# Altium project AT89S52S双L298驱动控制器.PRJPCB
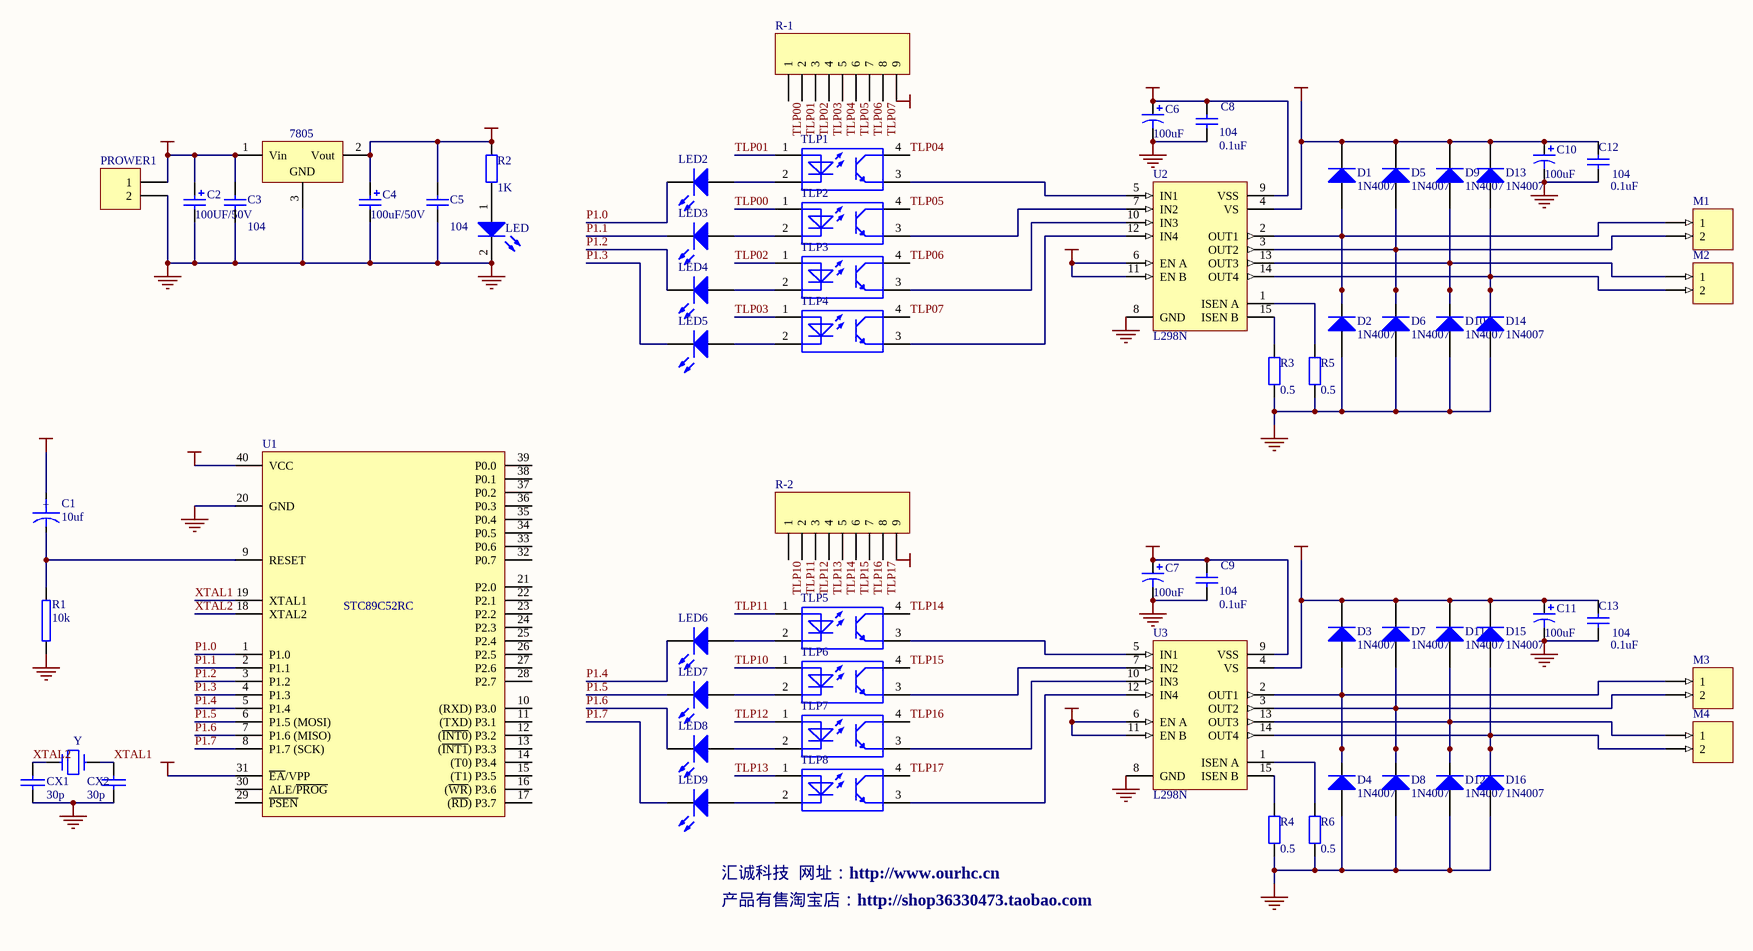
[diagram p0: AT89S52S双L298驱动控制器.SCHDOC]
1 sheet, 66 parts. Net scope: global (net labels, ports and power ports of the same name join across sheets).
Board file: AT89S52S双L298驱动控制器.PCBDOC

## Sheet AT89S52S双L298驱动控制器.SCHDOC
size A3

### Parts
7805  SDWYG  [WYG]  (value not drawn)
C1  10uf  [C-DJ-4]
C2  value 100UF/50V  [C-DJ-6]  (hidden comment: DJDR)
C3  value 104  [CPDR]  (hidden comment: CPDR)
C4  value 100uF/50V  [C-DJ-6]  (hidden comment: DJDR)
C5  value 104  [CPDR]  (hidden comment: CPDR)
C6  value 100uF  [C-DJ-6]
C7  value 100uF  [C-DJ-6]
C8  104  value 0.1uF  [CPDR]
C9  104  value 0.1uF  [CPDR]
C10  value 100uF  [C-DJ-6]
C11  value 100uF  [C-DJ-6]
C12  104  value 0.1uF  [CPDR]
C13  104  value 0.1uF  [CPDR]
CX1  30p  [HDR1X2]
CX2  30p  [HDR1X2]
D1  1N4007  [DIO7.8-4.6x2]
D2  1N4007  [DIO7.8-4.6x2]
D3  1N4007  [DIO7.8-4.6x2]
D4  1N4007  [DIO7.8-4.6x2]
D5  1N4007  [DIO7.8-4.6x2]
D6  1N4007  [DIO7.8-4.6x2]
D7  1N4007  [DIO7.8-4.6x2]
D8  1N4007  [DIO7.8-4.6x2]
D9  1N4007  [DIO7.8-4.6x2]
D10  1N4007  [DIO7.8-4.6x2]
D11  1N4007  [DIO7.8-4.6x2]
D12  1N4007  [DIO7.8-4.6x2]
D13  1N4007  [DIO7.8-4.6x2]
D14  1N4007  [DIO7.8-4.6x2]
D15  1N4007  [DIO7.8-4.6x2]
D16  1N4007  [DIO7.8-4.6x2]
LED1  LED  [LED_D]
LED2  (no value)  [LED_D]
LED3  (no value)  [LED_D]
LED4  (no value)  [LED_D]
LED5  (no value)  [LED_D]
LED6  (no value)  [LED_D]
LED7  (no value)  [LED_D]
LED8  (no value)  [LED_D]
LED9  (no value)  [LED_D]
M1  (no value)  [DYDZ]
M2  (no value)  [DYDZ]
M3  (no value)  [DYDZ]
M4  (no value)  [DYDZ]
PROWER1  PZ_2  [DYDZ]  (value not drawn)
R1  10k  [RSE]
R2  value 1K  [RSE]  (hidden comment: Res)
R3  value 0.5  [ZCDZL]  (hidden comment: Res2)
R4  value 0.5  [ZCDZL]  (hidden comment: Res2)
R5  value 0.5  [ZCDZL]  (hidden comment: Res2)
R6  value 0.5  [ZCDZL]  (hidden comment: Res2)
R-1  (no value)  [HDR1X9]
R-2  (no value)  [HDR1X9]
TLP1  (no value)  [DIP-4]
TLP2  (no value)  [DIP-4]
TLP3  (no value)  [DIP-4]
TLP4  (no value)  [DIP-4]
TLP5  (no value)  [DIP-4]
TLP6  (no value)  [DIP-4]
TLP7  (no value)  [DIP-4]
TLP8  (no value)  [DIP-4]
U1  STC89C52RC  [DIP-40]
U2  L298N  [L298N]
U3  L298N  [L298N]
Y1  Y  [JZ_ZC]

### Nets
+5V: 7805.2(Vout) C1.1 C4.1 C5.2 C6.1 C7.1 C8.2 C9.2 R2.2 R-1.9 R-2.9 U1.31(~{EA}/VPP) U1.40(VCC) U2.6(EN_A) U2.9(VSS) U2.11(EN_B) U3.6(EN_A) U3.9(VSS) U3.11(EN_B)
+12V: 7805.1(Vin) C2.1 C3.2 C10.1 C11.1 C12.2 C13.2 D1.2(K) D3.2(K) D5.2(K) D7.2(K) D9.2(K) D11.2(K) D13.2(K) D15.2(K) PROWER1.1 U2.4(VS) U3.4(VS)
GND: 7805.3(GND) C2.2 C3.1 C4.2 C5.1 C6.2 C7.2 C8.1 C9.1 C10.2 C11.2 C12.1 C13.1 CX1.2 CX2.2 D2.1(A) D4.1(A) D6.1(A) D8.1(A) D10.1(A) D12.1(A) D14.1(A) D16.1(A) LED1.2(K) PROWER1.2 R1.1 R3.1 R4.1 R5.1 R6.1 U1.20(GND) U2.8(GND) U3.8(GND)
P1.0: LED2.2(K) U1.1(P1.0)
P1.1: LED3.2(K) U1.2(P1.1)
P1.2: LED4.2(K) U1.3(P1.2)
P1.3: LED5.2(K) U1.4(P1.3)
P1.4: LED6.2(K) U1.5(P1.4)
P1.5: LED7.2(K) U1.6(P1.5_(MOSI))
P1.6: LED8.2(K) U1.7(P1.6_(MISO))
P1.7: LED9.2(K) U1.8(P1.7_(SCK))
TLP00: R-1.1 TLP2.1
TLP01: R-1.2 TLP1.1
TLP02: R-1.3 TLP3.1
TLP03: R-1.4 TLP4.1
TLP04: R-1.5 TLP1.4
TLP05: R-1.6 TLP2.4
TLP06: R-1.7 TLP3.4
TLP07: R-1.8 TLP4.4
TLP10: R-2.1 TLP6.1
TLP11: R-2.2 TLP5.1
TLP12: R-2.3 TLP7.1
TLP13: R-2.4 TLP8.1
TLP14: R-2.5 TLP5.4
TLP15: R-2.6 TLP6.4
TLP16: R-2.7 TLP7.4
TLP17: R-2.8 TLP8.4
XTAL1: CX2.1 U1.19(XTAL1) Y1.1
XTAL2: CX1.1 U1.18(XTAL2) Y1.2
NetC1_2: C1.2 R1.2 U1.9(RESET)
NetD1_1: D1.1(A) D2.2(K) M1.1 U2.2(OUT1)
NetD3_1: D3.1(A) D4.2(K) M3.1 U3.2(OUT1)
NetD5_1: D5.1(A) D6.2(K) M1.2 U2.3(OUT2)
NetD7_1: D7.1(A) D8.2(K) M3.2 U3.3(OUT2)
NetD9_1: D9.1(A) D10.2(K) M2.1 U2.13(OUT3)
NetD11_1: D11.1(A) D12.2(K) M4.1 U3.13(OUT3)
NetD13_1: D13.1(A) D14.2(K) M2.2 U2.14(OUT4)
NetD15_1: D15.1(A) D16.2(K) M4.2 U3.14(OUT4)
NetLED1_1: LED1.1(A) R2.1
NetLED2_1: LED2.1(A) TLP1.2
NetLED3_1: LED3.1(A) TLP2.2
NetLED4_1: LED4.1(A) TLP3.2
NetLED5_1: LED5.1(A) TLP4.2
NetLED6_1: LED6.1(A) TLP5.2
NetLED7_1: LED7.1(A) TLP6.2
NetLED8_1: LED8.1(A) TLP7.2
NetLED9_1: LED9.1(A) TLP8.2
NetR3_2: R3.2 U2.15(ISEN_B)
NetR4_2: R4.2 U3.15(ISEN_B)
NetR5_2: R5.2 U2.1(ISEN_A)
NetR6_2: R6.2 U3.1(ISEN_A)
NetTLP1_3: TLP1.3 U2.5(IN1)
NetTLP2_3: TLP2.3 U2.7(IN2)
NetTLP3_3: TLP3.3 U2.10(IN3)
NetTLP4_3: TLP4.3 U2.12(IN4)
NetTLP5_3: TLP5.3 U3.5(IN1)
NetTLP6_3: TLP6.3 U3.7(IN2)
NetTLP7_3: TLP7.3 U3.10(IN3)
NetTLP8_3: TLP8.3 U3.12(IN4)

Not connected (* = marked no-connect by the designer): U1 10((RXD)_P3.0) 11((TXD)_P3.1) 12((~{INT0})_P3.2) 13((~{INT1})_P3.3) 14((T0)_P3.4) 15((T1)_P3.5) 16((~{WR})_P3.6) 17((~{RD})_P3.7) 21(P2.0) 22(P2.1) 23(P2.2) 24(P2.3) 25(P2.4) 26(P2.5) 27(P2.6) 28(P2.7) 29(~{PSEN}) 30(ALE/~{PROG}) 32(P0.7) 33(P0.6) 34(P0.5) 35(P0.4) 36(P0.3) 37(P0.2) 38(P0.1) 39(P0.0)

### Notes on the sheet
- 汇诚科技  网址：http://www.ourhc.cn
- 产品有售淘宝店：http://shop36330473.taobao.com
- (in symbol CAPACITOR POL) +

### Library data of the parts
7805 = SDWYG: 三端稳压器; Published: 24-Mar-1999; LatestRevisionDate: 17-Jul-2002; LatestRevisionNote: Re-released for DXP Platform.; Publisher: Altium Limited; Code_JEDEC: SMD-220
C1 = CAPACITOR POL: Capacitor
C2 C4 = DJDR: 电解电容; Published: 8-Jun-2000; LatestRevisionDate: 17-Jul-2002; LatestRevisionNote: Re-released for DXP Platform.; Publisher: Altium Limited
C3 C5 = CPDR: 瓷片电容; Published: 8-Jun-2000; LatestRevisionDate: 17-Jul-2002; LatestRevisionNote: Re-released for DXP Platform.; Publisher: Altium Limited
C6 C7 C10 C11 = Cap Pol3: Polarized Capacitor (Surface Mount); Published: 8-Jun-2000; LatestRevisionDate: 17-Jul-2002; LatestRevisionNote: Re-released for DXP Platform.; PackageReference: C0805; Publisher: Altium Limited
C8 C9 C12 C13 = Cap: Capacitor; Published: 8-Jun-2000; LatestRevisionDate: 17-Jul-2002; LatestRevisionNote: Re-released for DXP Platform.; Publisher: Altium Limited
CX1 CX2 = CAP: Capacitor
D1-D16 = Diode 1N4007: 1 Amp General Purpose Rectifier; Published: 8-Jun-2000; LatestRevisionDate: 17-Jul-2002; LatestRevisionNote: Re-released for DXP Platform.; DatasheetDocument: 1998; PackageDocument: Aug-1999; PackageReference: DO-41; Publisher: Altium Limited; Code_JEDEC: DO-204-AL
LED1 = LED: 发光二极管; Published: 8-Jun-2000; LatestRevisionDate: 17-Jul-2002; LatestRevisionNote: Re-released for DXP Platform.; Publisher: Altium Limited
LED2-LED9 = LED3: Typical BLUE SiC LED; Published: 8-Jun-2000; LatestRevisionDate: 17-Dec-2003; LatestRevisionNote: PCB Footprint replaced.; Publisher: Altium Limited
M1-M4 = MHDR1X2: Header, 2-Pin; LatestRevisionDate: 17-Jul-2002; LatestRevisionNote: Re-released for DXP Platform.; Publisher: Altium Limited
PROWER1 = PZ_2: 排针——2; LatestRevisionDate: 17-Jul-2002; LatestRevisionNote: Re-released for DXP Platform.; Publisher: Altium Limited
R1 = RES2
R2 = Res: 电阻; Published: 8-Jun-2000; LatestRevisionDate: 17-Jul-2002; LatestRevisionNote: Re-released for DXP Platform.; Publisher: Altium Limited
R3-R6 = Res2: Resistor; Published: 8-Jun-2000; LatestRevisionDate: 17-Jul-2002; LatestRevisionNote: Re-released for DXP Platform.; Publisher: Altium Limited
R-1 R-2 = Header 9: Header, 9-Pin; Revision: 17-Jul-2002: Re-released for DXP Platform.; Publisher: Altium Limited
TLP1-TLP8 = TLP521-1
U1 = AT89S52-P: 8 位微处理器/40引脚; 子类别: 微处理器; 发布者: 磊元工作室; 发布日期: 2003年8月18日; 制造商: Atmel Corporation; 类别: 集成电路; 元件名称（国标）: 8 位微处理器; 元件名称（英文）: 8-bit Microcontroller; 特性:存储器容量: Flash：8KB  ，RAM：256B; 特性:定时器/计数器: 3 个 16-bit
U2 U3 = L298N: Dual Full Bridge Driver; Published: 8-Jun-2000; LatestRevisionDate: 17-Jul-2002; LatestRevisionNote: Re-released for DXP Platform.; DatasheetDocument: Jul-1999; PackageDocument: Apr-1998; PackageReference: Multiwatt15H; Publisher: Altium Limited; ComponentLink1Description: Manufacturer Link; ComponentLink1URL: http://www.st.com/
Y1 = CRYSTAL